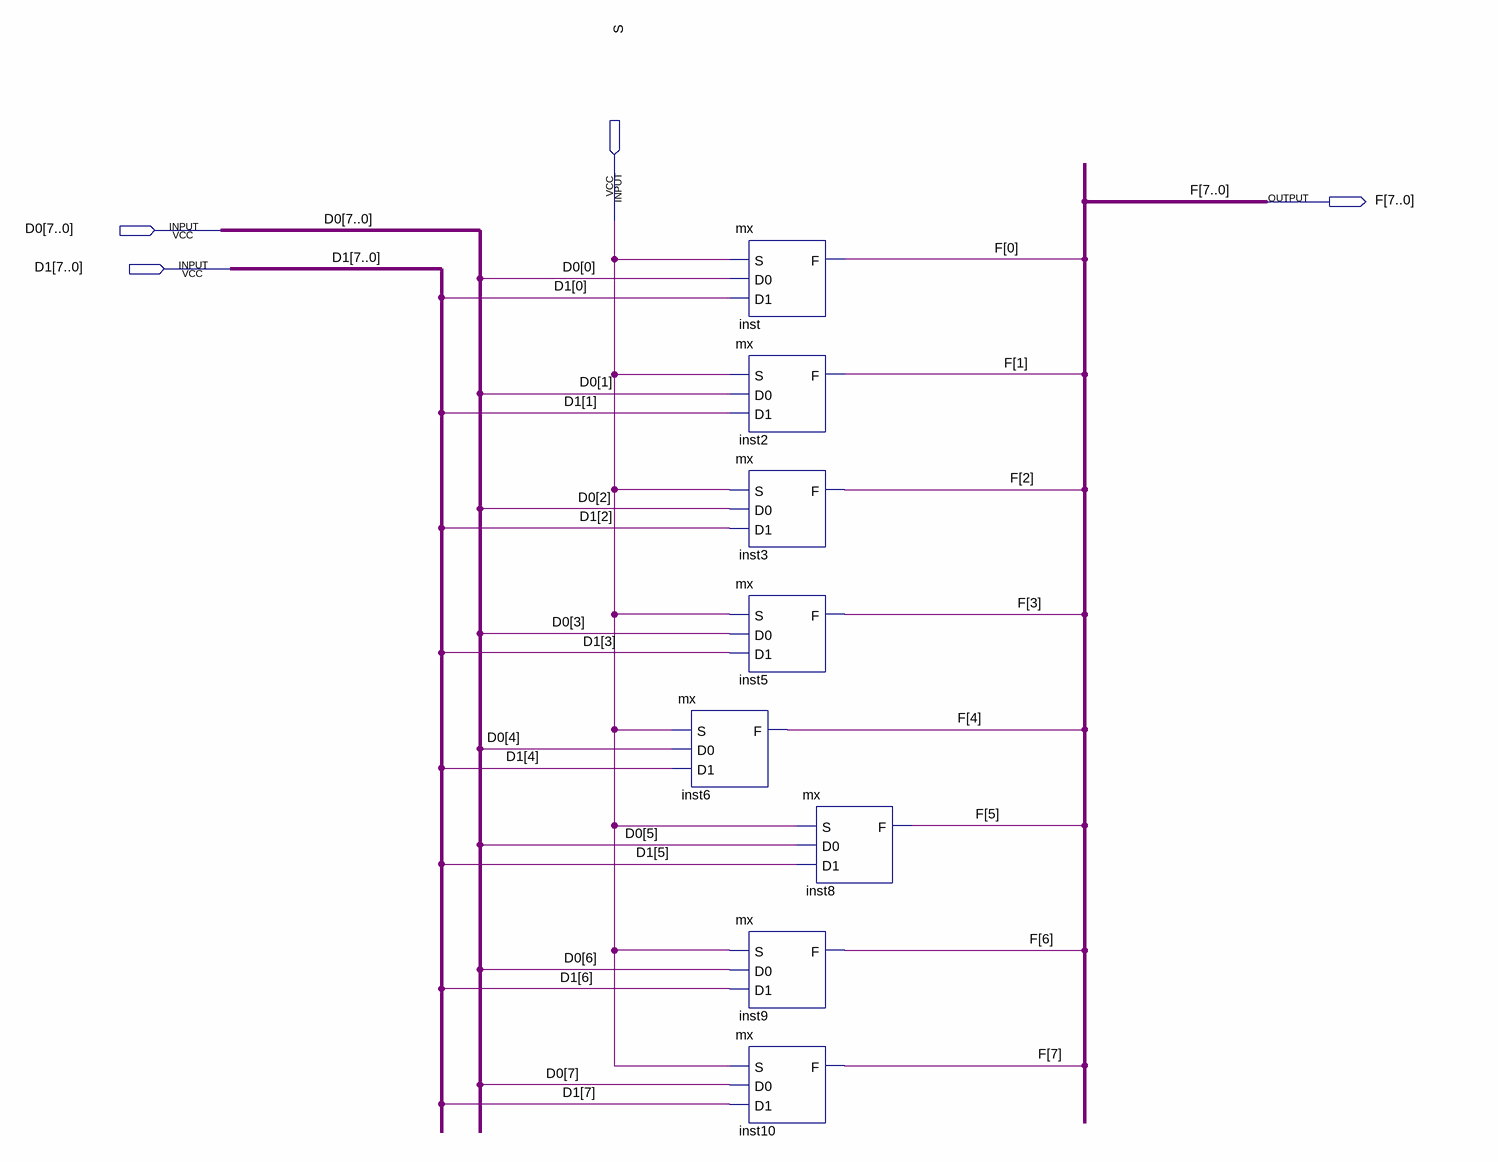
[diagram p0: schematic sheet]
// Quartus schematic MUX8bit.bdf as structural Verilog: 8 symbols, 4 pins
module MUX8bit (
  input  S,
  input  [7:0] D0,
  input  [7:0] D1,
  output [7:0] F
);

  mx inst6 (.S(S), .D0(D0[4]), .D1(D1[4]), .F(F[4]));
  mx inst (.S(S), .D0(D0[0]), .D1(D1[0]), .F(F[0]));
  mx inst2 (.S(S), .D0(D0[1]), .D1(D1[1]), .F(F[1]));
  mx inst3 (.S(S), .D0(D0[2]), .D1(D1[2]), .F(F[2]));
  mx inst5 (.S(S), .D0(D0[3]), .D1(D1[3]), .F(F[3]));
  mx inst8 (.S(S), .D0(D0[5]), .D1(D1[5]), .F(F[5]));
  mx inst9 (.S(S), .D0(D0[6]), .D1(D1[6]), .F(F[6]));
  mx inst10 (.S(S), .D0(D0[7]), .D1(D1[7]), .F(F[7]));
endmodule
